# Altium schematic sheet Block Diagram.SchDoc
size A3; PreparedBy: M. Berk AYDOĞAN; ChangedDate: 13.02.2021; ReleaseDate: 06.02.2021; ProjectDescription: Wireless Security Detector; Date: 10.03.2022; Engineer: Burak Gonulbagi; DocumentNumber: 2; Revision: 01; SheetNumber: 2; SheetTotal: 5; SheetSize: A3
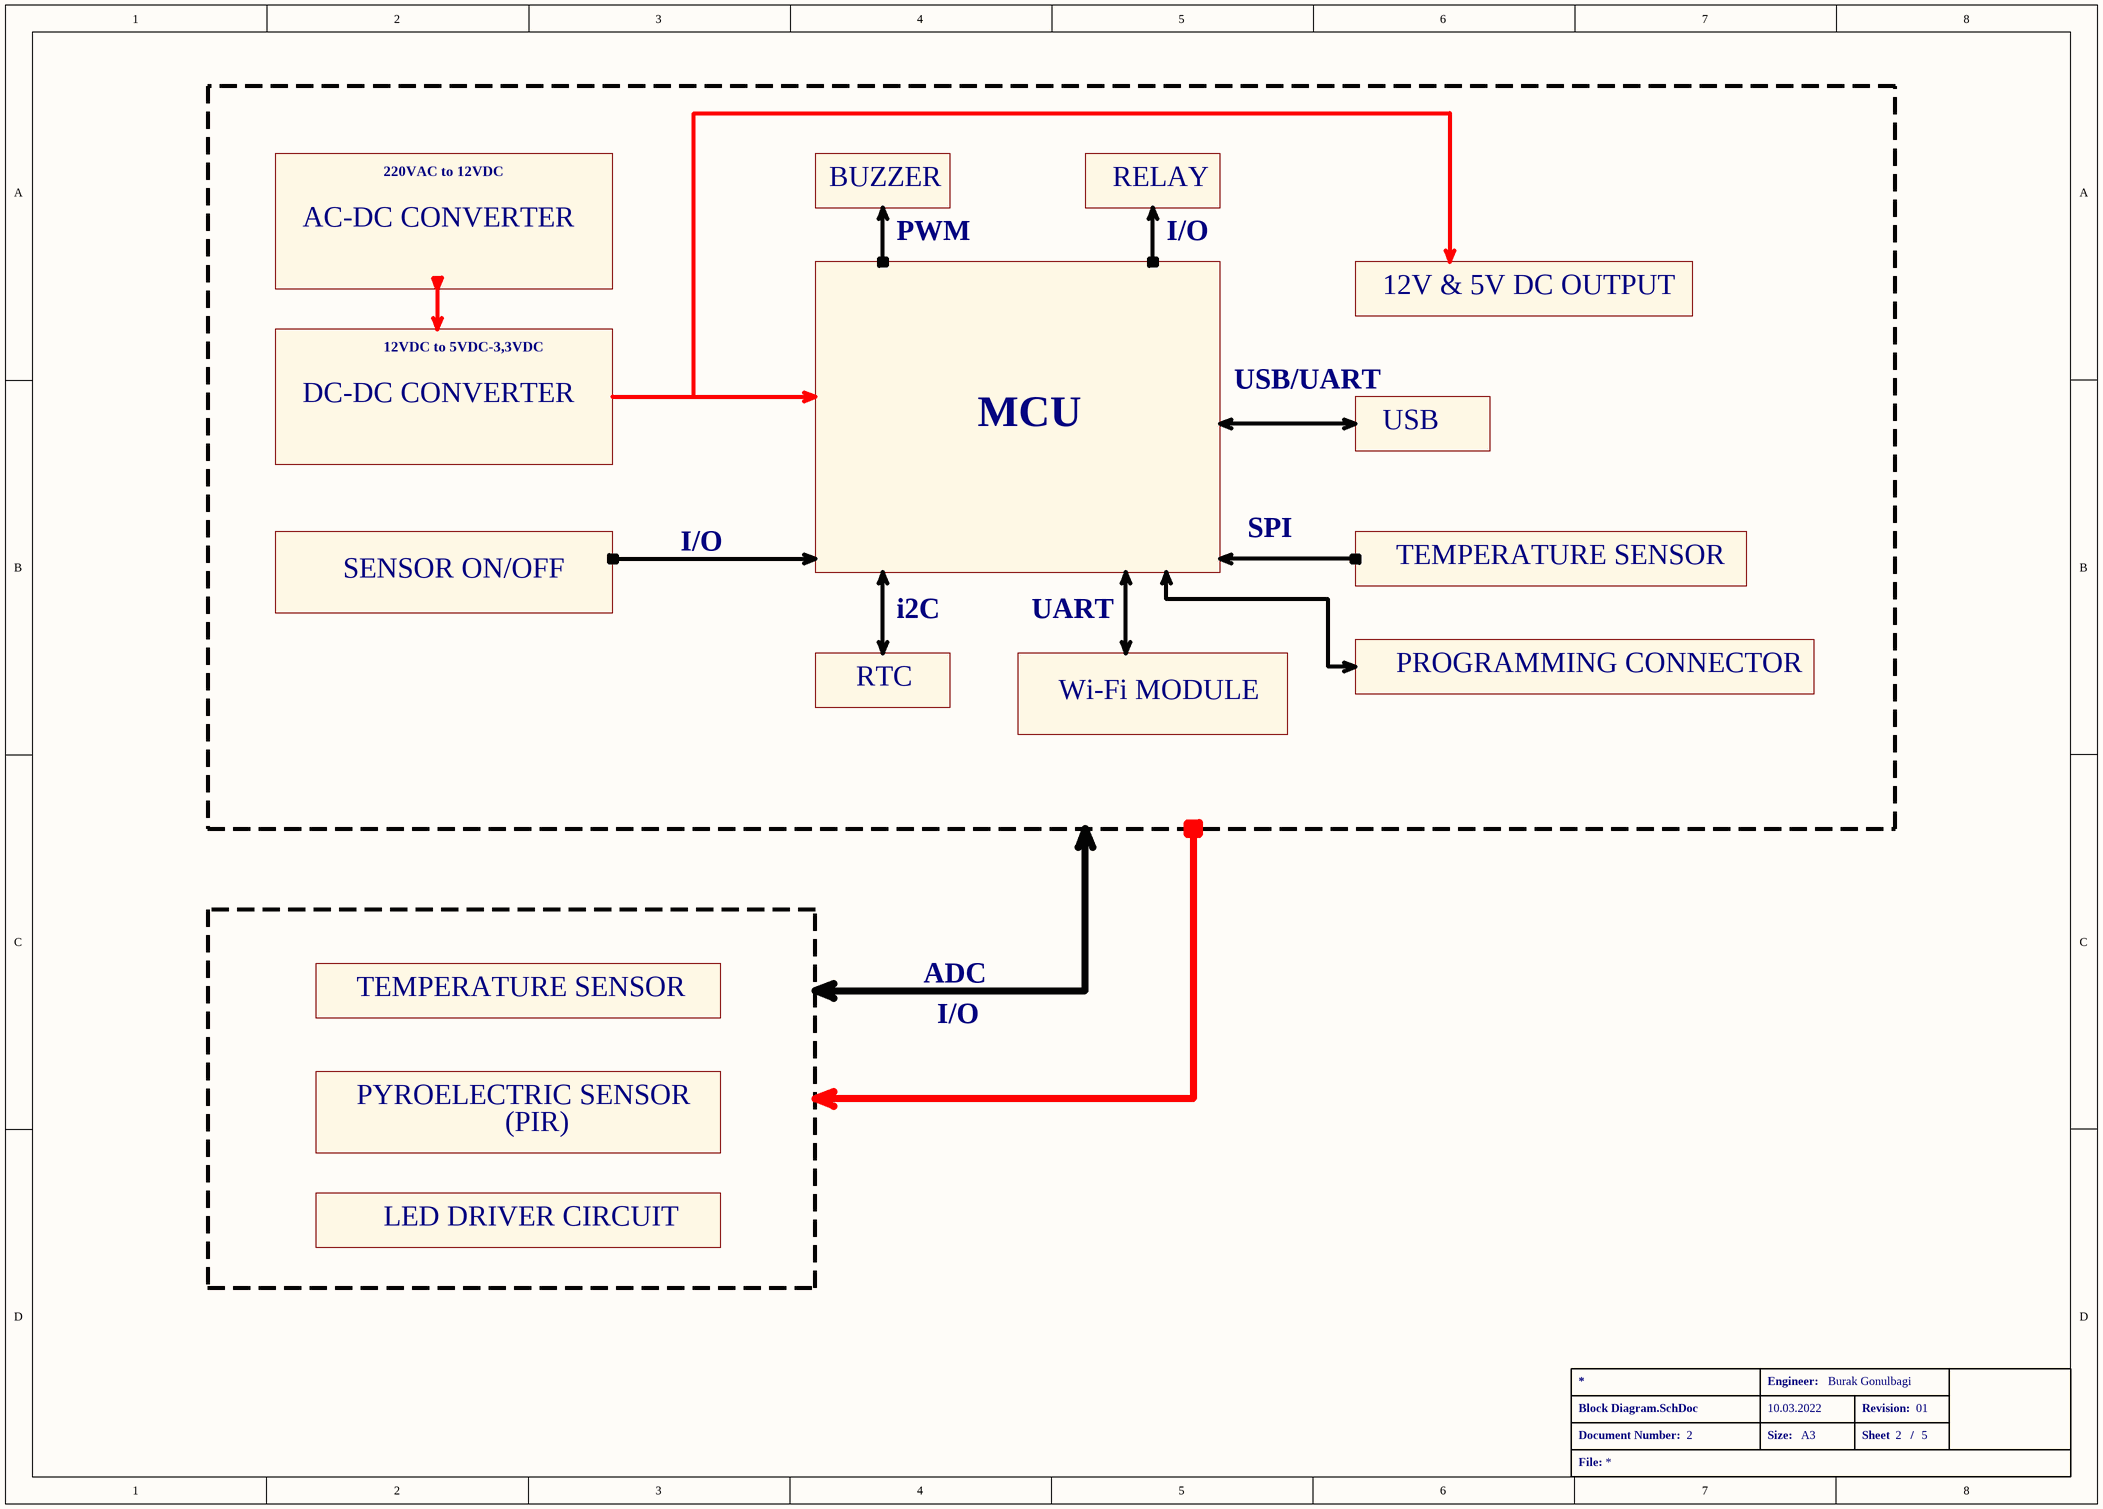
[diagram p0: Block Diagram.SchDoc]

## Notes on the sheet
- 220VAC to 12VDC
- AC-DC CONVERTER
- BUZZER
- PWM
- RELAY
- I/O
- 12V & 5V DC OUTPUT
- 12VDC to 5VDC-3,3VDC
- DC-DC CONVERTER
- MCU
- USB/UART
- USB
- SENSOR ON/OFF
- SPI
- TEMPERATURE SENSOR
- i2C
- UART
- RTC
- Wi-Fi MODULE
- PROGRAMMING CONNECTOR
- ADC
- PYROELECTRIC SENSOR
- (PIR)
- LED DRIVER CIRCUIT
- HABERLEŞME PROTOKOLLERİ
  SENKRON VE ASENKRON
  UART
  USART
  i2C
  SPI
- KOMPONENTLER:
  +RTC: M41T00
  +WIFI MODULE: ESP32-WROOM-32E (4MB)
  +PYRO SENSOR: LHI 878/3902
  TEMPERATURE OUTSIDE: +TFPT1206L1002FM
  TEMPERATURE INSIDE: MAX6662MSA+
  +MCU: STM32F103C6T6A
  +RELAY: ALQ112
  +BUZZER: CMI-9605IC-0580T
  +SENSOR ON/OFF: EG1215AA
  +AC-DC CONVERTER:
  +Trafo: BV302S12010-ZU
  +Bridge Diodes: DB105STR
  +DC-DC CONVERTER:
  +5VDC:LM2675MX-12/NOPB
  +3.3VDC:AP7361-33E-13
  +LED DRIVER MOSFET: SSM3K357R,LF
- Resistors: RC0603FR-0710KL
  Capacitor: C0603C104K4RACTU
  ALA7DA471CF450
  PCR1E471MCL1GS
- KOMPONENT TEDARİK SİTELERİ
  Digi-Key
  Mouser
  Farnell
  RS Component
  LCSC
- Engineer:
- Document Number:
- Size:
- Sheet
- Revision:
- /
- File: